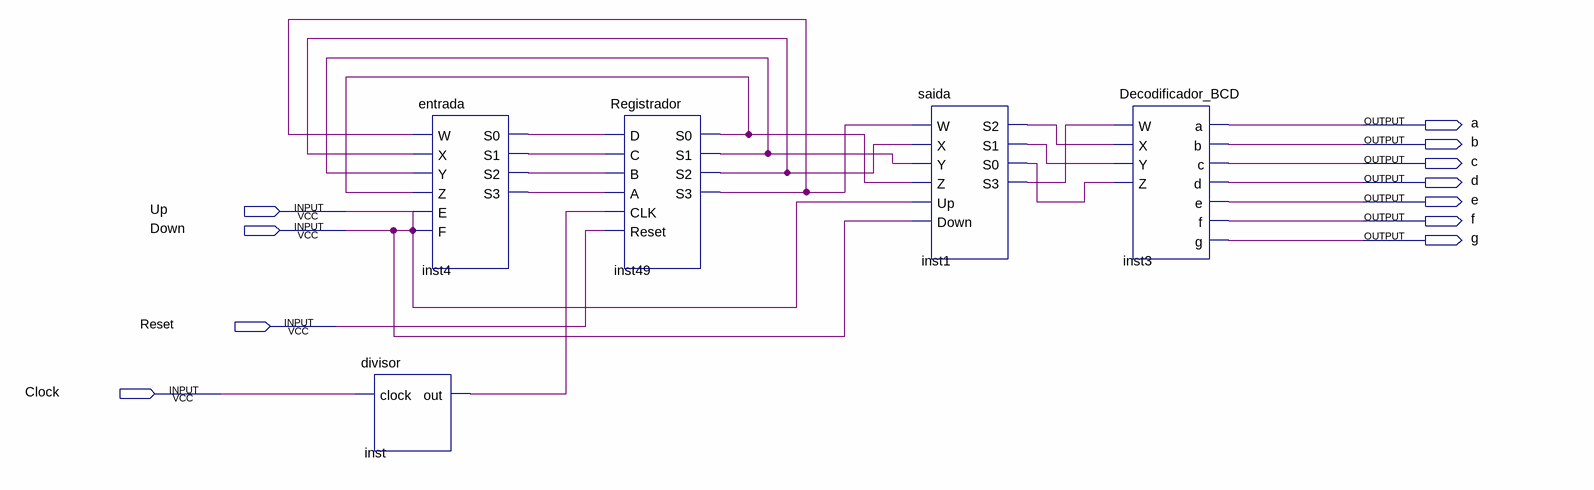
[diagram p0: schematic sheet]
// Quartus schematic MaqMuler_Vinicius_Ecard.bdf as structural Verilog: 5 symbols, 11 pins
module MaqMuler_Vinicius_Ecard (
  input  Up,
  input  Down,
  input  Reset,
  input  Clock,
  output a,
  output b,
  output c,
  output d,
  output e,
  output f,
  output g
);

  wire inst1_s0, inst1_s1, inst1_s2, inst1_s3, inst4_s0, inst4_s1, inst4_s2, inst4_s3, inst49_s0, inst49_s1,
       inst49_s2, inst49_s3, inst_out;

  entrada inst4 (
    .W(inst49_s3), .X(inst49_s2), .Y(inst49_s1), .Z(inst49_s0), .E(Down), .F(Down), .S0(inst4_s0),
    .S1(inst4_s1), .S2(inst4_s2), .S3(inst4_s3));
  divisor inst (.clock(Clock), .out(inst_out));
  Registrador inst49 (
    .D(inst4_s0), .C(inst4_s1), .B(inst4_s2), .A(inst4_s3), .CLK(inst_out), .Reset(Reset), .S0(inst49_s0),
    .S1(inst49_s1), .S2(inst49_s2), .S3(inst49_s3));
  saida inst1 (
    .W(inst49_s3), .X(inst49_s2), .Y(inst49_s1), .Z(inst49_s0), .Up(Down), .Down(Down), .S2(inst1_s2),
    .S1(inst1_s1), .S0(inst1_s0), .S3(inst1_s3));
  Decodificador_BCD inst3 (
    .W(inst1_s3), .X(inst1_s2), .Y(inst1_s1), .Z(inst1_s0), .a(a), .b(b), .c(c), .d(d), .e(e), .f(f), .g(g));

  assign Up = Down;
endmodule
